# EAGLE design LM386-Audio-Amplifier (EAGLE 7.2.0)
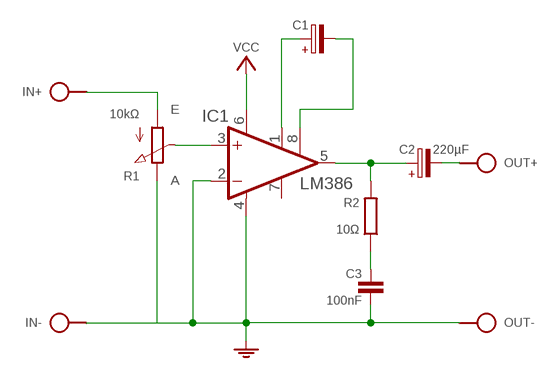
[diagram p0: schematic, sheet 1]

## Parts
C1  CPOL-HE2,5-3  [E2,5-3]
C2  220µF  CPOL-HE5-5  [E5-5]
C3  100nF  C050-020X044  [C050-020X044]
IC1  LM386  LM386N-1  [DIL08]
IN  SPAD+-+-  [SPAD+-]
OUT  SPAD+--+  [SPAD-+]
R1  10kΩ  POT-3P  [CONN-3P]
R2  10Ω  R0204/10-V  [0204/10-V]
S1  4-12V  VCC_GNDPWR-R  [PWR-R]

## Nets
GND: C3.2 IC1.2(-IN) IC1.4(GND) IN.1 OUT.1 R1.3(E) S1.1
N$1: IC1.3(+IN) R1.2(S)
N$2: IN.2 R1.1(A)
N$4: C1.+ IC1.1(GAIN)
N$5: C1.- IC1.8(GAIN)
N$6: C3.1 R2.2
N$7: C2.+ IC1.5(OUT) R2.1
N$8: C2.- OUT.2
VCC: IC1.6(VS) S1.2
Unconnected: IC1.7(BYPASS)

## Library data of the parts
C1 C2 = c:CPOL-H
C3 = c:C: CAPACITOR, European symbol
IC1 = ic:LM386?-*: Low Voltage Audio Power Amplifier Source: http://cache.national.com/ds/LM/LM386.pdf
IN OUT = pad:SPAD+-
R1 = r:POT
R2 = r:R: RESISTOR, European symbol
S1 = pad:VCC_GND

## Net classes
0 default: width 0.61 mm, clearance 0.61 mm

## Board
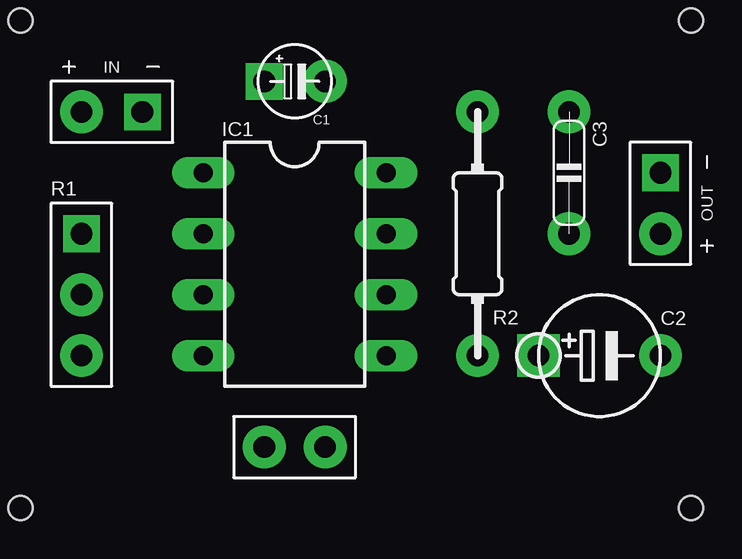
[diagram p1: board, top side]
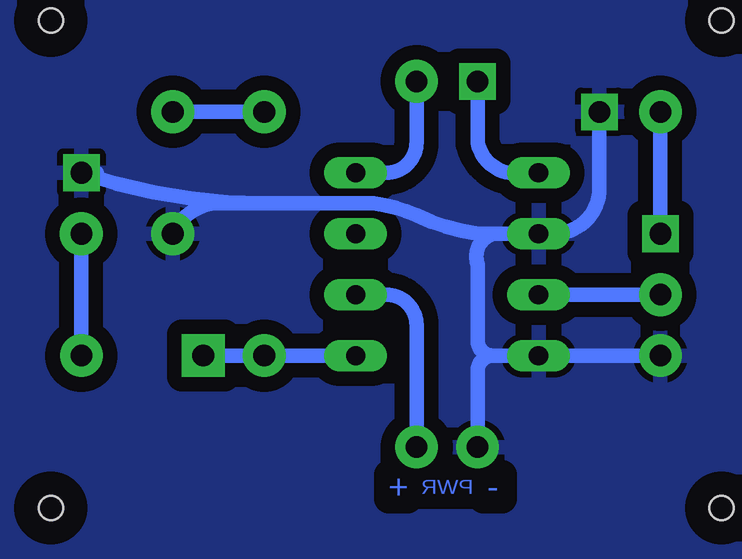
[diagram p2: board, bottom side, seen from below]

No outline drawn. Coordinates in mm, seen from the top.
Copper layers (1*16): Top 0.035mm / dielectric 1.5mm / Bottom 0.035mm
Design rules "default": minimum track width 10mil, minimum drill 24mil, track to track 8mil, track to pad 8mil, pad to pad 8mil, via to via 8mil, smd to smd 8mil, copper to edge 40mil, drill to drill 8mil, minimum pad ring 10mil, minimum via ring 8mil, stop-mask expansion 4mil, vias tented up to drill 0mil, thermal gap 10mil
Holes 1 mm at 1.27,21.59 1.27,1.27 29.21,1.27 29.21,21.59

### Footprints (pad centres in the part's own frame; a part is rotated, then mirrored left to right if it is on the bottom)
E2,5-3 = drill 0.9 pad 1.524 square: + -1.27,0 | drill 0.9 pad 1.778: - 1.27,0
E5-5 = drill 0.9 pad 1.778 square: + -2.54,0 | drill 0.9 pad 1.778: - 2.54,0
C050-020X044 = drill 0.9 pad 1.778: 1 -2.54,0; 2 2.54,0
DIL08 = drill 0.8 pad 1.27 long: 1 -3.81,3.81; 2 -3.81,1.27; 3 -3.81,-1.27; 4 -3.81,-3.81; 5 3.81,-3.81; 6 3.81,-1.27; 7 3.81,1.27; 8 3.81,3.81
SPAD+- = drill 0.9 pad 1.524 square: 1 0,-1.27 | drill 0.9 pad 1.778: 2 0,1.27
SPAD-+ = drill 0.9 pad 1.524 square: 1 0,-1.27 | drill 0.9 pad 1.778: 2 0,1.27
CONN-3P = drill 0.9 pad 1.524 square: 1 0,2.54 | drill 0.9 pad 1.778: 2 0,0; 3 0,-2.54
0204/10-V = drill 0.9 pad 1.778: 1 0,5.08; 2 0,-5.08
PWR-R = drill 0.9 pad 1.778: 1 0,-1.27; 2 0,1.27

### Placement (x,y rotation side)
C1  12.7,19.05 0 top
C2  25.4,7.62 0 top
C3  24.13,15.24 270 top
IC1  12.7,11.43 0 top
IN  5.08,17.78 90 top
OUT  27.94,13.97 180 top
R1  3.81,10.16 0 top
R2  20.32,12.7 180 top
S1  12.7,3.81 270 top

### Tracks (layer width: path | path; a pad name or v marks a point on that pad's centre or on a via)
GND
  Bottom 0.61: 10.79,12.7 arc-90 11.43,11.43 11.43,8.26 arc-90 10.79,7.62 | R1.3 IC1.4 10.79,7.62 | IN.1 6.35,14.61 arc90 8.26,12.7 IC1.2 10.79,12.7 | 10.79,12.7 11.43,12.7 arc15 13.97,13.46 arc-15 15.75,13.97 20.32,13.97 | S1.1 11.43,6.99 arc90 10.79,7.62 | 27.3,15.24 OUT.1 arc-19 20.32,13.97 | 20.32,13.97 22.35,13.97 arc-60 C3.2
  pour Bottom: -1.27,24.13 33.02,24.13 33.02,-1.27 -1.27,-1.27
N$1
  Bottom 0.61: IC1.3 R1.2
N$2
  Bottom 0.61: R1.1 IN.2
N$4
  Bottom 0.61: IC1.1 9.53,15.24 arc90 11.43,16.51 C1.+
N$5
  Bottom 0.61: IC1.8 15.24,15.24 arc-90 13.97,16.51 C1.-
N$6
  Bottom 0.61: R2.2 C3.1
N$7
  Bottom 0.61: IC1.5 R2.1 C2.+
N$8
  Bottom 0.61: C2.- OUT.2
VCC
  Bottom 0.61: IC1.6 15.24,10.16 arc90 13.97,8.89 S1.2